# EAGLE design breakout (EAGLE 9.6.2)
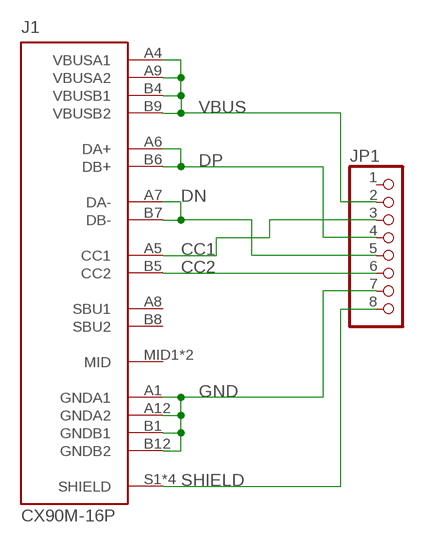
[diagram p0: schematic, sheet 1]

## Parts
J1  CX90M-16P  [HRS_CX90M-16P]
JP1  PINHD-1X8CLEANBIG  [1X08-CLEANBIG]

## Nets
CC1: J1.A5(CC1) JP1.3
CC2: J1.B5(CC2) JP1.6
DN: J1.A7(DA-) J1.B7(DB-) JP1.5
DP: J1.A6(DA+) J1.B6(DB+) JP1.4
GND: J1.A1(GNDA1) J1.A12(GNDA2) J1.B1(GNDB1) J1.B12(GNDB2) JP1.7
SHIELD: J1.S1(SHIELD) J1.S2(SHIELD) J1.S3(SHIELD) J1.S4(SHIELD) JP1.8
VBUS: J1.A4(VBUSA1) J1.A9(VBUSA2) J1.B4(VBUSB1) J1.B9(VBUSB2) JP1.2
Unconnected: J1.A8(SBU1) J1.B8(SBU2) J1.MID1(MID) J1.MID2(MID) JP1.1

## Library data of the parts
J1 = CX90M-16P:CX90M-16P: USB-C (USB TYPE-C) USB 3.1 (USB 3.1 Gen 2, Superspeed+) Receptacle Connector 24 (16+8 Dummy) Position Board Edge, Cutout; Surface Mount; Through Hole, Right Angle Check prices <https://pricing.snapeda.com/parts/CX90M-16P/Hirose%20Electric%20Co%20Ltd/view-part?ref=eda>; AVAILABILITY: Warning; DESCRIPTION: USB-C (USB TYPE-C) USB 3.2 Gen 2 (USB 3.1 Gen 2, Superspeed + (USB 3.1)) Receptacle Connector 24 (16+8 Dummy) Position Board Edge, Cutout; Surface Mount; Through Hole, Right Angle; MF: Hirose Electric Co Ltd; MP: CX90M-16P; PACKAGE: None; PRICE: None; PURCHASE-URL: https://pricing.snapeda.com/search/part/CX90M-16P/?ref=eda
JP1 = adafruit:PINHD-1X8: PIN HEADER

## Board
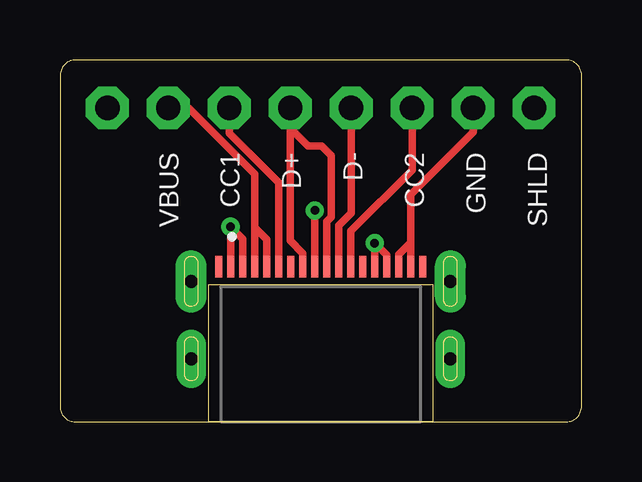
[diagram p1: board, top side]
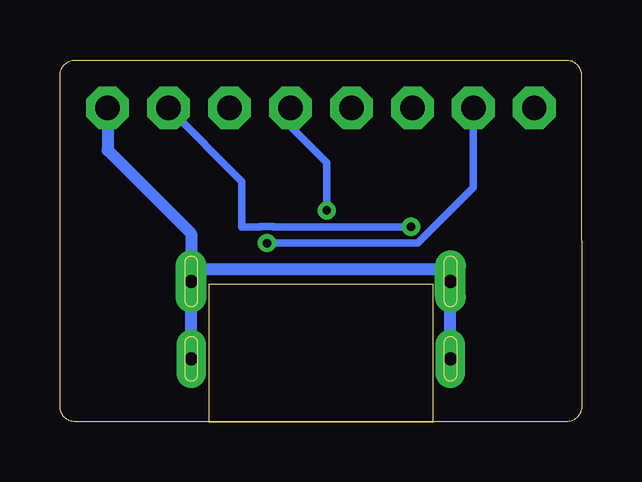
[diagram p2: board, bottom side, seen from below]

Size 21.73 x 15.09 mm. Coordinates in mm from the lower left corner, seen from the top.
Outline: 0.01,14.48 0,0.62 arc90 0.64,0 21.1,0 arc90 21.73,0.64 21.73,14.45 arc90 21.1,15.09 0.66,15.09 arc90 0.01,14.48
Copper layers (1*16): Top 0.035mm / dielectric 1.5mm / Bottom 0.035mm
Design rules "default": minimum track width 6mil, minimum drill 0.35mm, track to track 6mil, track to pad 6mil, pad to pad 6mil, via to via 6mil, smd to smd 6mil, copper to edge 40mil, drill to drill 6mil, minimum pad ring 10mil, minimum via ring 8mil, stop-mask expansion 4mil, vias tented up to drill 0mil, thermal gap 10mil
Milling: 4 lines

### Footprints (pad centres in the part's own frame; a part is rotated, then mirrored left to right if it is on the bottom)
HRS_CX90M-16P = smd 0.3 x 0.9: A1 -3.75,3.85; A4 -2.75,3.85; A5 -1.75,3.85; A6 -0.75,3.85; A7 0.75,3.85; A8 1.75,3.85; A9 2.75,3.85; A12 3.75,3.85; B1 3.25,3.85; B4 2.25,3.85; B5 1.25,3.85; B6 0.25,3.85; B7 -0.25,3.85; B8 -1.25,3.85; B9 -2.25,3.85; B12 -3.25,3.85; MID1 -4.25,3.85; MID2 4.25,3.85 | drill 0.55 pad 1.3 long: S1 -5.4,3.23; S2 5.4,3.23 | drill 0.55 pad 1.225 long: S3 -5.4,0; S4 5.4,0
1X08-CLEANBIG = drill 1.016 pad 1.778 octagon: 1 -8.89,0; 2 -6.35,0; 3 -3.81,0; 4 -1.27,0; 5 1.27,0; 6 3.81,0; 7 6.35,0; 8 8.89,0

### Placement (x,y rotation side)
J1  10.87,2.62 0 top
JP1  10.86,13.09 0 top

### Tracks (layer width: path | path; a pad name or v marks a point on that pad's centre or on a via)
CC1
  Top 0.305: J1.A5 9.12,9.97 7.05,12.04 JP1.3
CC2
  Top 0.305: JP1.6 14.67,10.5 12.12,7.95 J1.B5
DN  (via drill 0.35)
  Top 0.305: J1.B7 v10.62,8.81 | J1.A7 11.62,8.2 12.13,8.71 JP1.5
  Bottom 0.305: v10.62,8.81 10.62,10.81 12.13,12.32 JP1.5
DP
  Top 0.305: J1.A6 10.12,7.02 9.59,7.55 9.59,12.26 9.6,12.25 | J1.B6 11.12,8.34 11.3,8.53 11.3,11.1 10.9,11.5 10.35,11.5 9.6,12.25 | JP1.4 9.6,12.25
GND  (via drill 0.35)
  Top 0.305: J1.B12 7.62,7.62 v7.11,8.13 v7.12,8.12 J1.A1 | J1.A12 14.62,7.48 14.61,7.47 | 14.61,7.47 14.61,9.47 17.21,12.07 JP1.7 | J1.B1 14.12,6.98 | 14.12,6.98 14.61,7.47 | 14.11,6.97 14.12,6.98
  Bottom 0.305: v7.11,8.13 12.82,8.13 12.83,8.13 13.39,8.13 14.15,8.13 14.15,10.03 JP1.7
SHIELD
  Bottom 0.508: J1.S3 J1.S1 5.96,6.34 | J1.S2 15.78,6.34 5.97,6.34 | J1.S4 J1.S2 | JP1.8 19.75,11.33 16.27,7.84 J1.S2
VBUS  (via drill 0.35)
  Top 0.305: J1.B4 v13.12,7.44 | J1.A9 13.62,6.94 | 13.61,6.95 v13.12,7.44 | v13.12,7.44 v13.11,7.45 | J1.A4 8.12,8.09 | J1.B9 8.62,7.59 8.11,8.1 8.11,10.33 5.36,13.09 JP1.2
  Bottom 0.305: v13.11,7.45 6.82,7.45 4.51,9.76 JP1.2

### Text on the board
tSilk: VBUS / CC1 / D+ / D- / CC2 / GND / SHLD